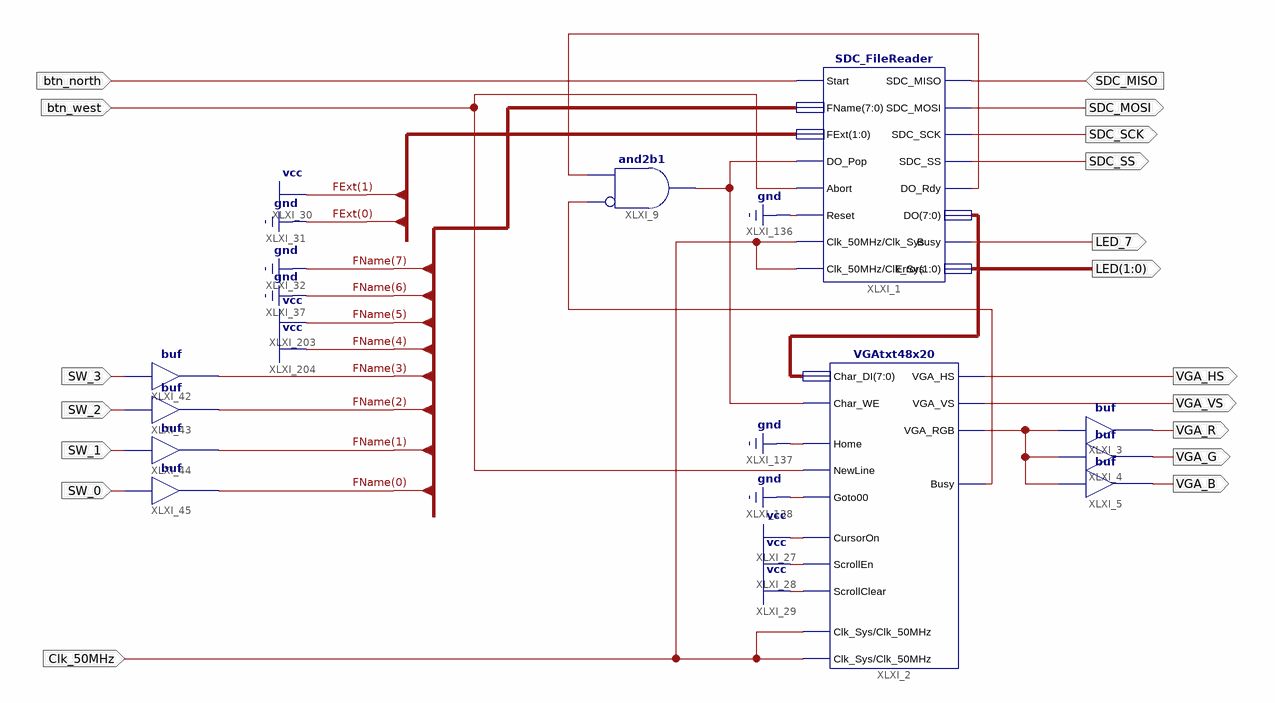
[diagram p0: schematic sheet 1]
// Xilinx ISE schematic typing_tutor.sch (spartan3e) as structural Verilog: 10 symbols, 18 ports
module typing_tutor (
  input  SDC_MISO,
  input  btn_north,
  input  Clk_50MHz,
  input  btn_west,
  input  SW_3,
  input  SW_0,
  input  SW_1,
  input  SW_2,
  output SDC_SS,
  output SDC_SCK,
  output SDC_MOSI,
  output LED_7,
  output [1:0] LED,
  output VGA_VS,
  output VGA_HS,
  output VGA_G,
  output VGA_B,
  output VGA_R
);

  wire XLXN_7, XLXN_17, XLXN_66, XLXN_564;
  wire [3:0] FName;
  wire [7:0] XLXN_5;

  SDC_FileReader XLXI_1 (
    .SDC_MISO(SDC_MISO), .Start(btn_north), .FName({4'b0011, FName}), .Reset(1'b0), .Clk_50MHz(Clk_50MHz),
    .DO_Pop(XLXN_7), .Abort(btn_west), .SDC_MOSI(SDC_MOSI), .SDC_SCK(SDC_SCK), .SDC_SS(SDC_SS), .Error(LED),
    .DO(XLXN_5), .DO_Rdy(XLXN_66), .Busy(LED_7), .FExt(2'b10), .Clk_Sys(Clk_50MHz));
  and XLXI_9 (XLXN_7, ~XLXN_17, XLXN_66);  // and2b1
  buf XLXI_3 (VGA_R, XLXN_564);
  buf XLXI_4 (VGA_G, XLXN_564);
  buf XLXI_5 (VGA_B, XLXN_564);
  VGAtxt48x20 XLXI_2 (
    .Char_DI(XLXN_5), .Home(1'b0), .NewLine(btn_west), .Goto00(1'b0), .Clk_Sys(Clk_50MHz),
    .Clk_50MHz(Clk_50MHz), .CursorOn(1'b1), .ScrollEn(1'b1), .ScrollClear(1'b1), .Busy(XLXN_17),
    .VGA_HS(VGA_HS), .VGA_VS(VGA_VS), .VGA_RGB(XLXN_564), .Char_WE(XLXN_7));
  buf XLXI_42 (FName[3], SW_3);
  buf XLXI_45 (FName[0], SW_0);
  buf XLXI_44 (FName[1], SW_1);
  buf XLXI_43 (FName[2], SW_2);
endmodule
